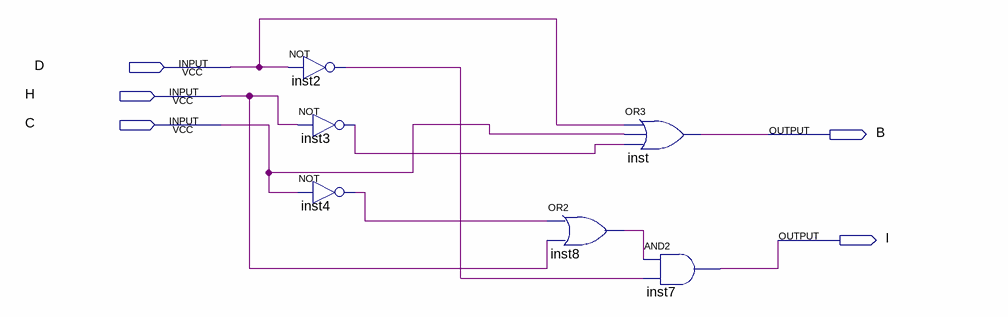
[diagram p0: schematic sheet]
// Quartus schematic labweek5.bdf as structural Verilog: 6 symbols, 5 pins
module labweek5 (
  input  D,
  input  H,
  input  C,
  output B,
  output I
);

  wire inst2_out, inst3_out, inst4_out, inst8_out;

  not inst2 (inst2_out, D);
  not inst3 (inst3_out, H);
  not inst4 (inst4_out, C);
  or inst8 (inst8_out, inst4_out, H);
  or inst (B, D, C, inst3_out);
  and inst7 (I, inst8_out, inst2_out);
endmodule
